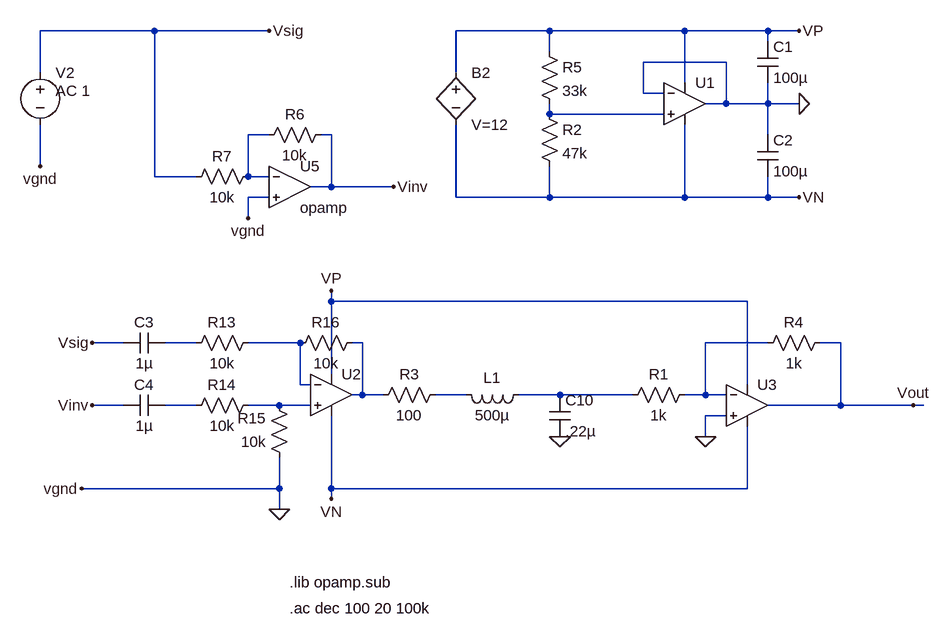
[diagram p0: schematic ltspice_simulation.asc]
ltspice_simulation.asc, the LTspice schematic file:
Version 4
SHEET 1 1112 1016
WIRE -144 64 -320 64
WIRE 32 64 -144 64
WIRE 464 64 320 64
WIRE 672 64 464 64
WIRE 800 64 672 64
WIRE 848 64 800 64
WIRE 800 80 800 64
WIRE 464 96 464 64
WIRE 736 112 608 112
WIRE -320 128 -320 64
WIRE 320 128 320 64
WIRE 672 144 672 64
WIRE 608 160 608 112
WIRE 640 160 608 160
WIRE 736 176 736 112
WIRE 736 176 704 176
WIRE 800 176 800 144
WIRE 800 176 736 176
WIRE 848 176 800 176
WIRE 464 192 464 176
WIRE 640 192 464 192
WIRE 32 224 0 224
WIRE 128 224 112 224
WIRE 800 224 800 176
WIRE -320 272 -320 208
WIRE -144 288 -144 64
WIRE -80 288 -144 288
WIRE 0 288 0 224
WIRE 32 288 0 288
WIRE 128 304 128 224
WIRE 128 304 96 304
WIRE 224 304 128 304
WIRE 32 320 0 320
WIRE 320 320 320 208
WIRE 464 320 464 272
WIRE 464 320 320 320
WIRE 672 320 672 208
WIRE 672 320 464 320
WIRE 800 320 800 288
WIRE 800 320 672 320
WIRE 848 320 800 320
WIRE 0 352 0 320
WIRE 128 480 128 464
WIRE 768 480 128 480
WIRE -192 544 -240 544
WIRE -80 544 -128 544
WIRE 80 544 0 544
WIRE 176 544 160 544
WIRE 800 544 704 544
WIRE 912 544 880 544
WIRE 128 592 128 480
WIRE 80 608 80 544
WIRE 96 608 80 608
WIRE 768 608 768 480
WIRE 176 624 176 544
WIRE 176 624 160 624
WIRE 208 624 176 624
WIRE 336 624 288 624
WIRE 480 624 416 624
WIRE 592 624 480 624
WIRE 704 624 704 544
WIRE 704 624 672 624
WIRE 736 624 704 624
WIRE -192 640 -240 640
WIRE -80 640 -128 640
WIRE 48 640 0 640
WIRE 96 640 48 640
WIRE 912 640 912 544
WIRE 912 640 800 640
WIRE 1024 640 912 640
WIRE 1040 640 1024 640
WIRE 736 656 704 656
WIRE 704 688 704 656
WIRE 48 768 48 720
WIRE 48 768 -256 768
WIRE 128 768 128 656
WIRE 768 768 768 672
WIRE 768 768 128 768
WIRE 128 784 128 768
WIRE 48 800 48 768
FLAG 848 64 VP
FLAG 848 176 0
FLAG 848 320 VN
FLAG 128 784 VN
FLAG 128 464 VP
FLAG 704 688 0
FLAG 1024 640 Vout
FLAG -240 544 Vsig
FLAG -240 640 Vinv
FLAG -320 272 vgnd
FLAG 0 352 vgnd
FLAG -256 768 vgnd
FLAG 48 800 0
FLAG 32 64 Vsig
FLAG 224 304 Vinv
FLAG 480 688 0
SYMBOL Opamps\\UniversalOpamp2 672 176 R0
SYMATTR InstName U1
SYMBOL Opamps\\UniversalOpamp2 128 624 R0
SYMATTR InstName U2
SYMBOL Opamps\\UniversalOpamp2 768 640 R0
SYMATTR InstName U3
SYMBOL res 304 608 R90
WINDOW 0 0 56 VBottom 2
WINDOW 3 32 56 VTop 2
SYMATTR InstName R3
SYMATTR Value 100
SYMBOL res 896 528 R90
WINDOW 0 0 56 VBottom 2
WINDOW 3 32 56 VTop 2
SYMATTR InstName R4
SYMATTR Value 1k
SYMBOL Opamps\\opamp 64 240 R0
SYMATTR InstName U5
SYMBOL res 128 208 R90
WINDOW 0 0 56 VBottom 2
WINDOW 3 32 56 VTop 2
SYMATTR InstName R6
SYMATTR Value 10k
SYMBOL res 16 272 R90
WINDOW 0 0 56 VBottom 2
WINDOW 3 32 56 VTop 2
SYMATTR InstName R7
SYMATTR Value 10k
SYMBOL voltage -320 112 R0
WINDOW 3 24 44 Left 2
WINDOW 123 0 0 Left 0
WINDOW 39 0 0 Left 0
SYMATTR Value AC 1
SYMATTR InstName V2
SYMBOL res 16 528 R90
WINDOW 0 0 56 VBottom 2
WINDOW 3 32 56 VTop 2
SYMATTR InstName R13
SYMATTR Value 10k
SYMBOL res 16 624 R90
WINDOW 0 0 56 VBottom 2
WINDOW 3 32 56 VTop 2
SYMATTR InstName R14
SYMATTR Value 10k
SYMBOL res 64 736 R180
WINDOW 0 36 76 Left 2
WINDOW 3 36 40 Left 2
SYMATTR InstName R15
SYMATTR Value 10k
SYMBOL res 64 560 R270
WINDOW 0 32 56 VTop 2
WINDOW 3 0 56 VBottom 2
SYMATTR InstName R16
SYMATTR Value 10k
SYMBOL cap 784 80 R0
SYMATTR InstName C1
SYMATTR Value 100µ
SYMBOL cap 784 224 R0
SYMATTR InstName C2
SYMATTR Value 100µ
SYMBOL cap -128 528 R90
WINDOW 0 0 32 VBottom 2
WINDOW 3 32 32 VTop 2
SYMATTR InstName C3
SYMATTR Value 1µ
SYMBOL cap -128 624 R90
WINDOW 0 0 32 VBottom 2
WINDOW 3 32 32 VTop 2
SYMATTR InstName C4
SYMATTR Value 1µ
SYMBOL bv 320 112 R0
SYMATTR InstName B2
SYMATTR Value V=12
SYMBOL res 688 608 R90
WINDOW 0 0 56 VBottom 2
WINDOW 3 32 56 VTop 2
SYMATTR InstName R1
SYMATTR Value 1k
SYMBOL cap 464 624 R0
SYMATTR InstName C10
SYMATTR Value .22µ
SYMBOL ind 432 608 R90
WINDOW 0 5 56 VBottom 2
WINDOW 3 32 56 VTop 2
SYMATTR InstName L1
SYMATTR Value 500µ
SYMBOL res 448 176 R0
SYMATTR InstName R2
SYMATTR Value 47k
SYMBOL res 448 80 R0
SYMATTR InstName R5
SYMATTR Value 33k
TEXT 64 912 Left 2 !.lib opamp.sub
TEXT 64 952 Left 2 !.ac dec 100 20 100k

The netlist it stands for:
* ltspice_simulation.asc
XU1 N001 0 VP VN 0 level.2 Avol=1Meg GBW=10Meg Slew=10Meg ilimit=25m rail=0 Vos=0 phimargin=45 en=0 enk=0 in=0 ink=0 Rin=500Meg  ; pins IN+ IN- V+ V- OUT
XU2 N010 N004 VP VN N005 level.2 Avol=1Meg GBW=10Meg Slew=10Meg ilimit=25m rail=0 Vos=0 phimargin=45 en=0 enk=0 in=0 ink=0 Rin=500Meg  ; pins IN+ IN- V+ V- OUT
XU3 0 N006 VP VN Vout level.2 Avol=1Meg GBW=10Meg Slew=10Meg ilimit=25m rail=0 Vos=0 phimargin=45 en=0 enk=0 in=0 ink=0 Rin=500Meg  ; pins IN+ IN- V+ V- OUT
R3 N007 N005 100
R4 Vout N006 1k
XU5 N002 0 Vinv opamp Aol=100K GBW=10Meg  ; pins invin noninvin out
R6 Vinv N002 10k
R7 N002 Vsig 10k
V2 Vsig 0 AC 1
R13 N004 N003 10k
R14 N010 N009 10k
R15 0 N010 10k
R16 N004 N005 10k
C1 VP 0 100µ
C2 0 VN 100µ
C3 N003 Vsig 1µ
C4 N009 Vinv 1µ
B2 VP VN V=12
R1 N006 N008 1k
C10 N008 0 .22µ
L1 N008 N007 500µ
R2 N001 VN 47k
R5 VP N001 33k
.lib opamp.sub
.ac dec 100 20 100k
.lib UniversalOpamps2.sub
.backanno
.end